# Altium schematic sheet eCabinet_eRouter.SchDoc
size A4
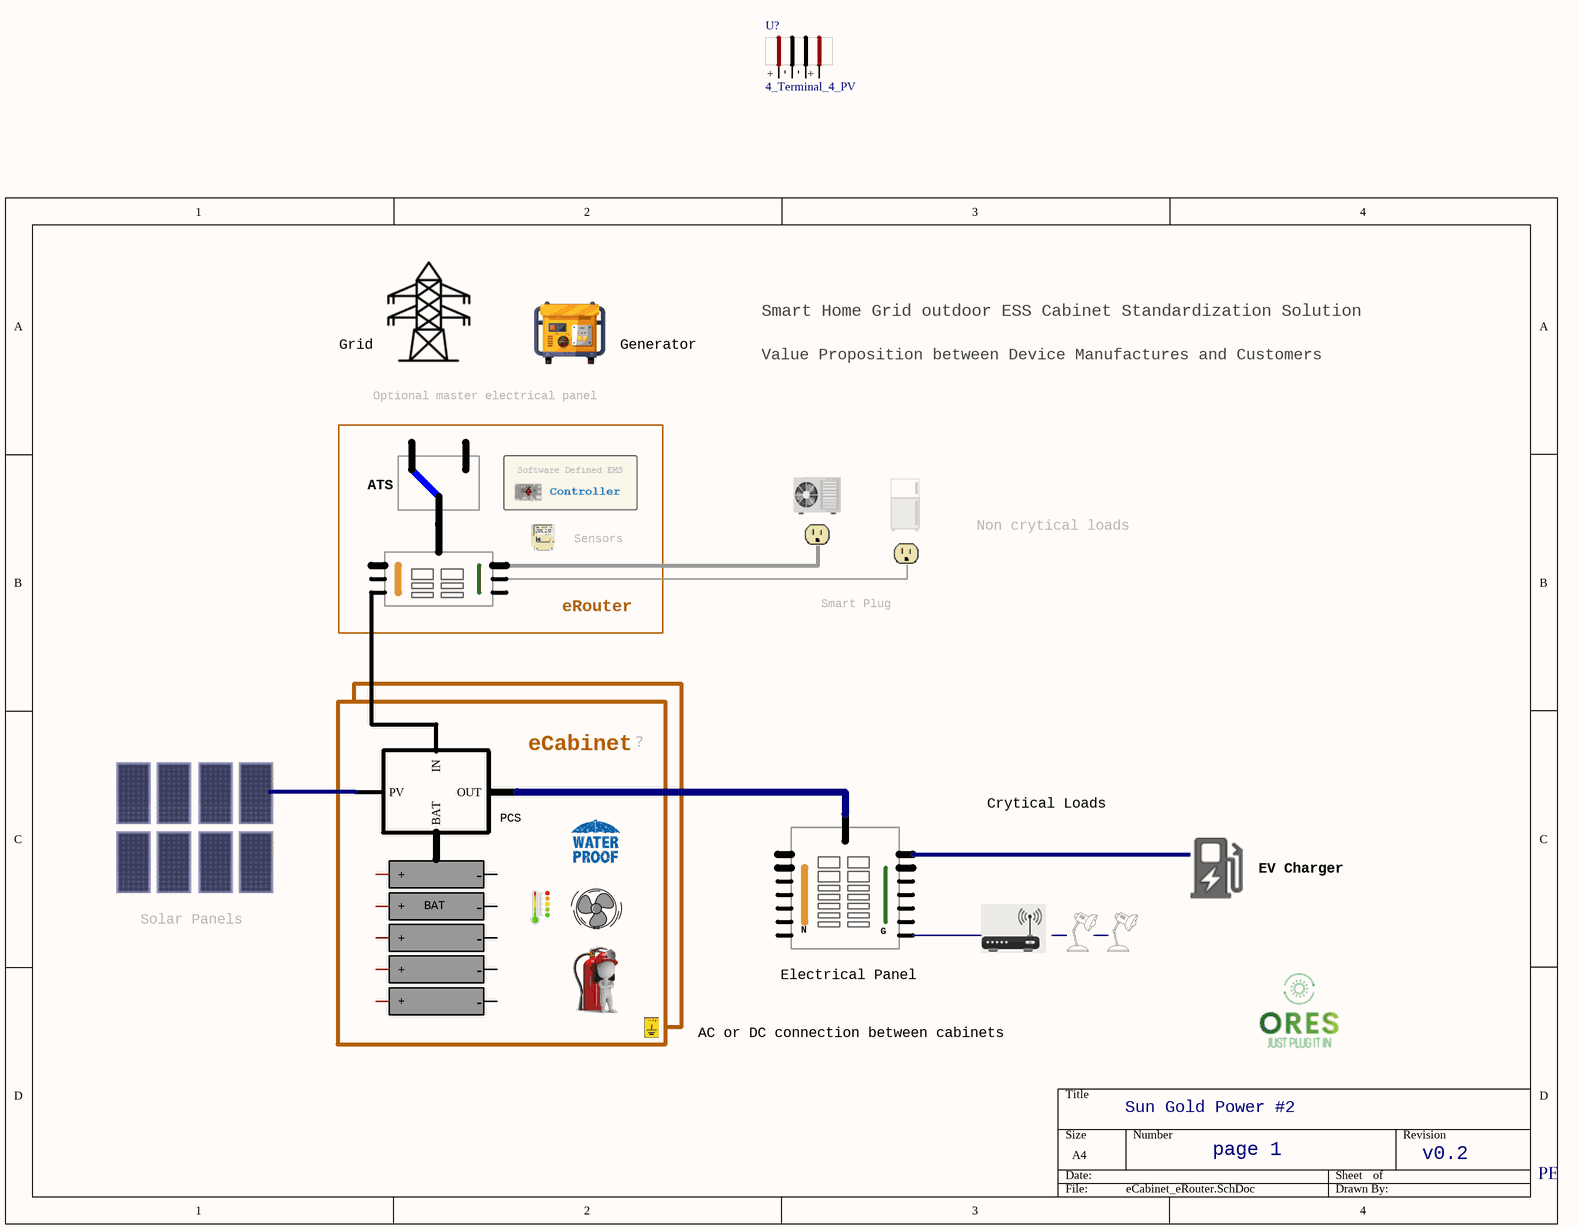
[diagram p0: eCabinet_eRouter.SchDoc]

## Parts
(Parts that share a designator on the sheet are numbered #1, #2 ... from top to bottom, then left to right.)
Battery?#1  1_BAT_48V_new  (value not drawn)
Battery?#2  1_BAT_48V_new  (value not drawn)
Battery?#3  1_BAT_48V_new  (value not drawn)
Battery?#4  1_BAT_48V_new  (value not drawn)
Battery?#5  1_BAT_48V_new  (value not drawn)
U?#1  4_Terminal_4_PV
U?#2  3_Relay_Transit  (value not drawn)
U?#3  6_Electrical_Panel_small  (value not drawn)
U?#4  6_Hybrid_Inverter  (value not drawn)
U?#5  6_Electrical_Panel  (value not drawn)

## Blocks framed on the sheet
eRouter: U?#2 U?#3
eCabinet: Battery?#1-Battery?#5 U?#4

## Nets
NetU?#3_2: U?#3.2 U?#4.1(IN)
NetU?#4_5: U?#4.5(OUT) U?#5.1

Not connected (* = marked no-connect by the designer): Battery?#1 1(-) 2(+); Battery?#2 1(-) 2(+); Battery?#3 1(-) 2(+); Battery?#4 1(-) 2(+); Battery?#5 1(-) 2(+); U?#1 + -; U?#2 1 2 3; U?#3 1; U?#4 2(PV) 4(BAT); U?#5 2

## Notes on the sheet
- Grid
- Generator
- Smart Home Grid outdoor ESS Cabinet Standardization Solution
- Value Proposition between Device Manufactures and Customers
- Optional master electrical panel
- (near U?#2) ATS
- Sensors
- Non crytical loads
- Smart Plug
- ？
- (near U?#4) PCS
- Crytical Loads
- (near Battery?#2) BAT
- EV Charger
- Solar Panels
- (near U?#5) Electrical Panel
- (near U?#5) N
- (near U?#5) G
- AC or DC connection between cabinets
- Sun Gold Power #2
- page 1
- v0.2
- PE